# Altium schematic sheet RS485.SchDoc
size A4
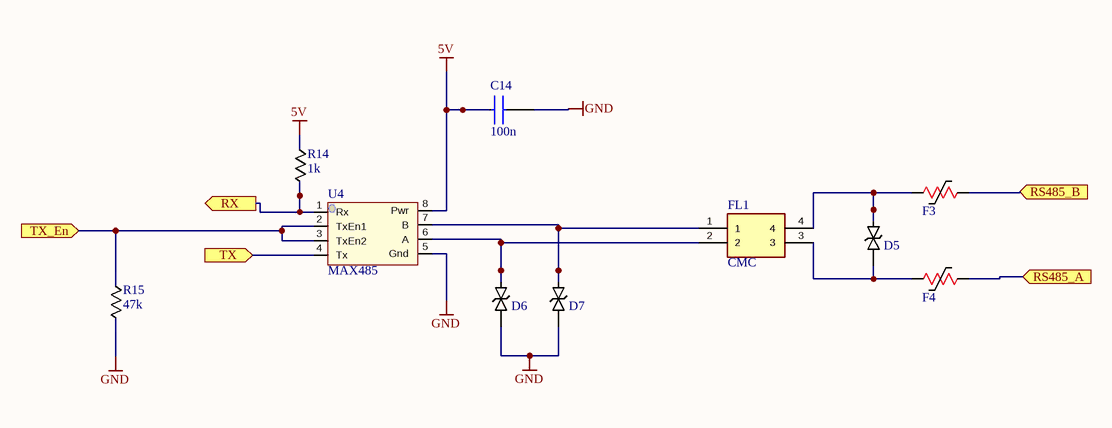
[diagram p0: RS485.SchDoc]

## Parts
C14  100n  [0603 CAP]
D5  TVS Diode  [DO-214AC / SMA]  (value not drawn)
D6  TVS Diode  [DO-214AC / SMA]  (value not drawn)
D7  TVS Diode  [DO-214AC / SMA]  (value not drawn)
F3  MF-USMF005-2  [MF-MSMF030-2]  (value not drawn)
F4  MF-USMF005-2  [MF-MSMF030-2]  (value not drawn)
FL1  CMC  [ACM20129002PT002]
R14  1k  [0603 CAP]
R15  47k  [0603 CAP]
U4  MAX485  [SOIC-8]

## Ports
RS485_A, RS485_B, RX, TX, TX_En

## Nets
5V: C14.2 R14.1 U4.8(Pwr)
GND: C14.1 D6.1 D7.1 R15.2 U4.5(Gnd)
RS485_A: F4.1 ; port RS485_A
RS485_B: F3.1 ; port RS485_B
RX: R14.2 U4.1(Rx) ; port RX
TX: U4.4(Tx) ; port TX
TX_En: R15.1 U4.2(TxEn1) U4.3(TxEn2) ; port TX_En
NetD5_1: D5.1 F4.2 FL1.3
NetD5_2: D5.2 F3.2 FL1.4
NetD6_2: D6.2 FL1.2 U4.6(A)
NetD7_2: D7.2 FL1.1 U4.7(B)

## Library data of the parts
C14 = 0603 CAP: CC0603KRX7R9BB104; Manufacturer_Name: Murata Electronics; Manufacturer_Part_Number: GRM188R72A103KA01D; Datasheet Link: https://search.murata.co.jp/Ceramy/image/img/A01X/G101/ENG/GRM188R72A103KA01-01A.pdf; Height: 0.9mm; Mouser Part Number: 81-GRM188R72A103KA1D; Mouser Price/Stock: https://www.mouser.co.uk/ProductDetail/Murata-Electronics/GRM188R72A103KA01D?qs=krk%2F6UQjCzAtl9phuocbug%3D%3D; Arrow Part Number: GRM188R72A103KA01D; Arrow Price/Stock: https://www.arrow.com/en/products/grm188r72a103ka01d/murata-manufacturing?region=europe
D5-D7 = TVS: TVS Protective Diode
F3 F4 = Fuse Resettable: Resettable Fuse Polyswitch
FL1 = ACM2012-900-2P-T002: Manufacturer_Name: TDK; Datasheet Link: https://product.tdk.com/system/files/dam/doc/product/emc/emc/cmf_cmc/catalog/cmf_commercial_signal_acm2012_en.pdf; Height: 1.3mm; Manufacturer_Part_Number: ACM2012-900-2P-T002; Mouser Part Number: 810-ACM20129002PT002; Mouser Price/Stock: https://www.mouser.co.uk/ProductDetail/TDK/ACM2012-900-2P-T002?qs=vhEaPADELPHXWaCJFQVZjQ%3D%3D; Arrow Part Number: ACM2012-900-2P-T002; Arrow Price/Stock: https://www.arrow.com/en/products/acm2012-900-2p-t002/tdk?utm_currency=USD&region=europe
R14 = 0603 RES
R15 = 0603 RES: RC0603FR-0747KL